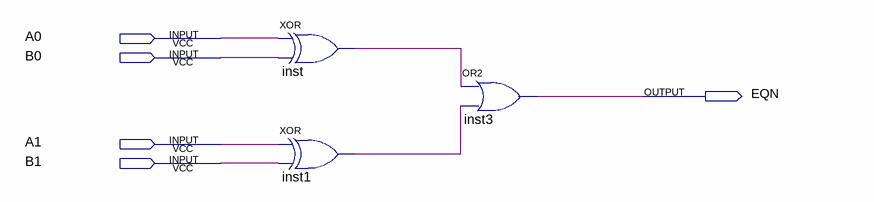
[diagram p0: schematic sheet]
// Quartus schematic eq_2bits.bdf as structural Verilog: 3 symbols, 5 pins
module eq_2bits (
  input  A0,
  input  B0,
  input  A1,
  input  B1,
  output EQN
);

  wire inst1_out, inst_out;

  xor inst (inst_out, A0, B0);
  xor inst1 (inst1_out, A1, B1);
  or inst3 (EQN, inst_out, inst1_out);
endmodule
